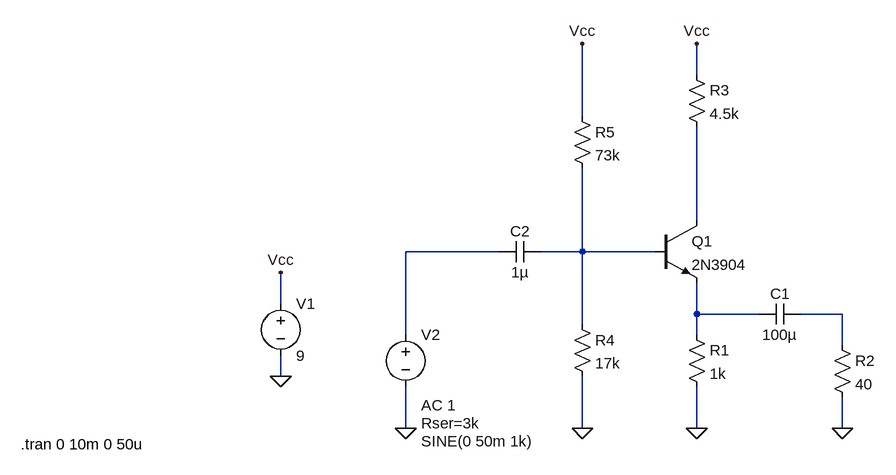
[diagram p0: schematic ce_amp_original.asc]
ce_amp_original.asc, the LTspice schematic file:
Version 4
SHEET 1 1016 680
WIRE 736 -224 736 -272
WIRE 560 -160 560 -272
WIRE 736 0 736 -144
WIRE 432 48 288 48
WIRE 560 48 560 -80
WIRE 560 48 496 48
WIRE 672 48 560 48
WIRE 96 128 96 80
WIRE 736 144 736 96
WIRE 832 144 736 144
WIRE 960 144 896 144
WIRE 560 160 560 48
WIRE 288 176 288 48
WIRE 736 176 736 144
WIRE 960 192 960 144
WIRE 96 240 96 208
WIRE 288 320 288 256
WIRE 560 320 560 240
WIRE 736 320 736 256
WIRE 960 320 960 272
FLAG 96 240 0
FLAG 96 80 Vcc
FLAG 736 320 0
FLAG 960 320 0
FLAG 736 -272 Vcc
FLAG 560 320 0
FLAG 560 -272 Vcc
FLAG 288 320 0
SYMBOL voltage 96 112 R0
WINDOW 123 0 0 Left 2
WINDOW 39 0 0 Left 2
SYMATTR InstName V1
SYMATTR Value 9
SYMBOL npn 672 0 R0
SYMATTR InstName Q1
SYMATTR Value 2N3904
SYMBOL res 720 160 R0
SYMATTR InstName R1
SYMATTR Value 1k
SYMBOL res 944 176 R0
SYMATTR InstName R2
SYMATTR Value 40
SYMBOL cap 832 160 R270
WINDOW 0 32 32 VTop 2
WINDOW 3 0 32 VBottom 2
SYMATTR InstName C1
SYMATTR Value 100µ
SYMBOL res 720 -240 R0
SYMATTR InstName R3
SYMATTR Value 4.5k
SYMBOL res 544 144 R0
SYMATTR InstName R4
SYMATTR Value 17k
SYMBOL res 544 -176 R0
SYMATTR InstName R5
SYMATTR Value 73k
SYMBOL cap 432 64 R270
WINDOW 0 32 32 VTop 2
WINDOW 3 0 32 VBottom 2
SYMATTR InstName C2
SYMATTR Value 1µ
SYMBOL voltage 288 160 R0
WINDOW 3 24 180 Left 2
WINDOW 123 24 124 Left 2
WINDOW 39 24 152 Left 2
SYMATTR Value SINE(0 50m 1k)
SYMATTR Value2 AC 1
SYMATTR SpiceLine Rser=3k
SYMATTR InstName V2
TEXT -304 344 Left 2 !.tran 0 10m 0 50u

The netlist it stands for:
* ce_amp_original.asc
V1 Vcc 0 9
Q1 N001 N003 N004 0 2N3904
R1 N004 0 1k
R2 N005 0 40
C1 N004 N005 100µ
R3 Vcc N001 4.5k
R4 N003 0 17k
R5 Vcc N003 73k
C2 N002 N003 1µ
V2 N002 0 SINE(0 50m 1k) AC 1 Rser=3k
.model NPN NPN
.model PNP PNP
.lib standard.bjt
.tran 0 10m 0 50u
.backanno
.end